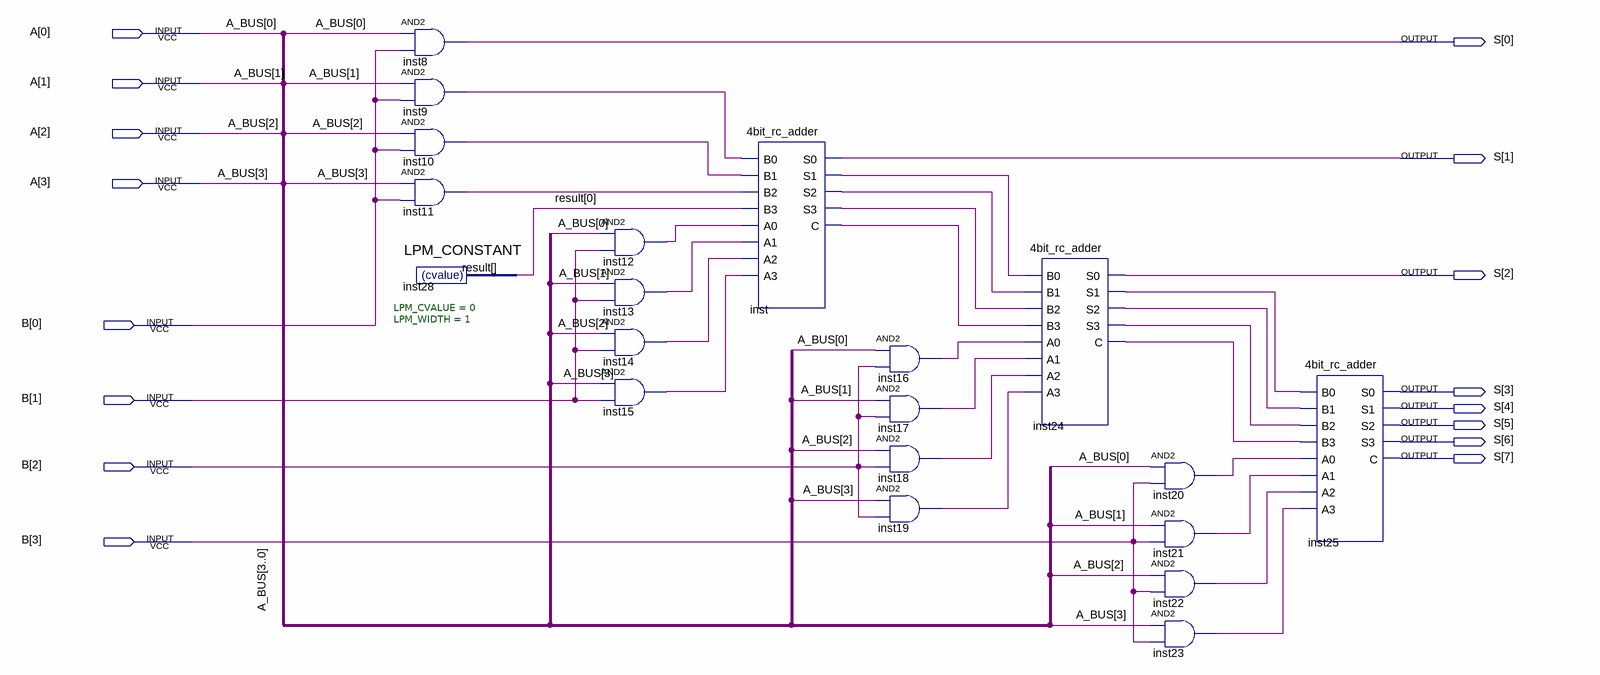
[diagram p0: schematic sheet]
// Quartus schematic hw_01.bdf as structural Verilog: 20 symbols, 16 pins
module hw_01 (
  input  [3:0] A,
  input  [3:0] B,
  output [7:0] S
);

  wire inst9_out, inst10_out, inst11_out, inst12_out, inst13_out, inst14_out, inst15_out, inst16_out,
       inst17_out, inst18_out, inst19_out, inst20_out, inst21_out, inst22_out, inst23_out, inst24_c,
       inst24_s1, inst24_s2, inst24_s3, inst_c, inst_s1, inst_s2, inst_s3;
  wire [0:0] result;

  and inst8 (S[0], A[0], B[0]);
  and inst9 (inst9_out, A[1], B[0]);
  and inst10 (inst10_out, A[2], B[0]);
  and inst11 (inst11_out, A[3], B[0]);
  LPM_CONSTANT #(.LPM_CVALUE(0), .LPM_WIDTH(1)) inst28 (.result(result[0]));
  and inst12 (inst12_out, A[0], B[1]);
  and inst13 (inst13_out, A[1], B[1]);
  and inst14 (inst14_out, A[2], B[1]);
  and inst15 (inst15_out, A[3], B[1]);
  \4bit_rc_adder  inst (
    .B0(inst9_out), .B1(inst10_out), .B2(inst11_out), .B3(result[0]), .A0(inst12_out), .A1(inst13_out),
    .A2(inst14_out), .A3(inst15_out), .S0(S[1]), .S1(inst_s1), .S2(inst_s2), .S3(inst_s3), .C(inst_c));
  and inst16 (inst16_out, A[0], B[2]);
  and inst17 (inst17_out, A[1], B[2]);
  and inst18 (inst18_out, A[2], B[2]);
  and inst19 (inst19_out, A[3], B[2]);
  \4bit_rc_adder  inst24 (
    .B0(inst_s1), .B1(inst_s2), .B2(inst_s3), .B3(inst_c), .A0(inst16_out), .A1(inst17_out), .A2(inst18_out),
    .A3(inst19_out), .S0(S[2]), .S1(inst24_s1), .S2(inst24_s2), .S3(inst24_s3), .C(inst24_c));
  and inst20 (inst20_out, A[0], B[3]);
  and inst21 (inst21_out, A[1], B[3]);
  and inst22 (inst22_out, A[2], B[3]);
  and inst23 (inst23_out, A[3], B[3]);
  \4bit_rc_adder  inst25 (
    .B0(inst24_s1), .B1(inst24_s2), .B2(inst24_s3), .B3(inst24_c), .A0(inst20_out), .A1(inst21_out),
    .A2(inst22_out), .A3(inst23_out), .S0(S[3]), .S1(S[4]), .S2(S[5]), .S3(S[6]), .C(S[7]));

  // Other names for the same wires on the sheet: A_BUS[3:0] = A
endmodule
